# EAGLE board TinyNES_Main_Board (EAGLE 9.6.2), part 1 of 2
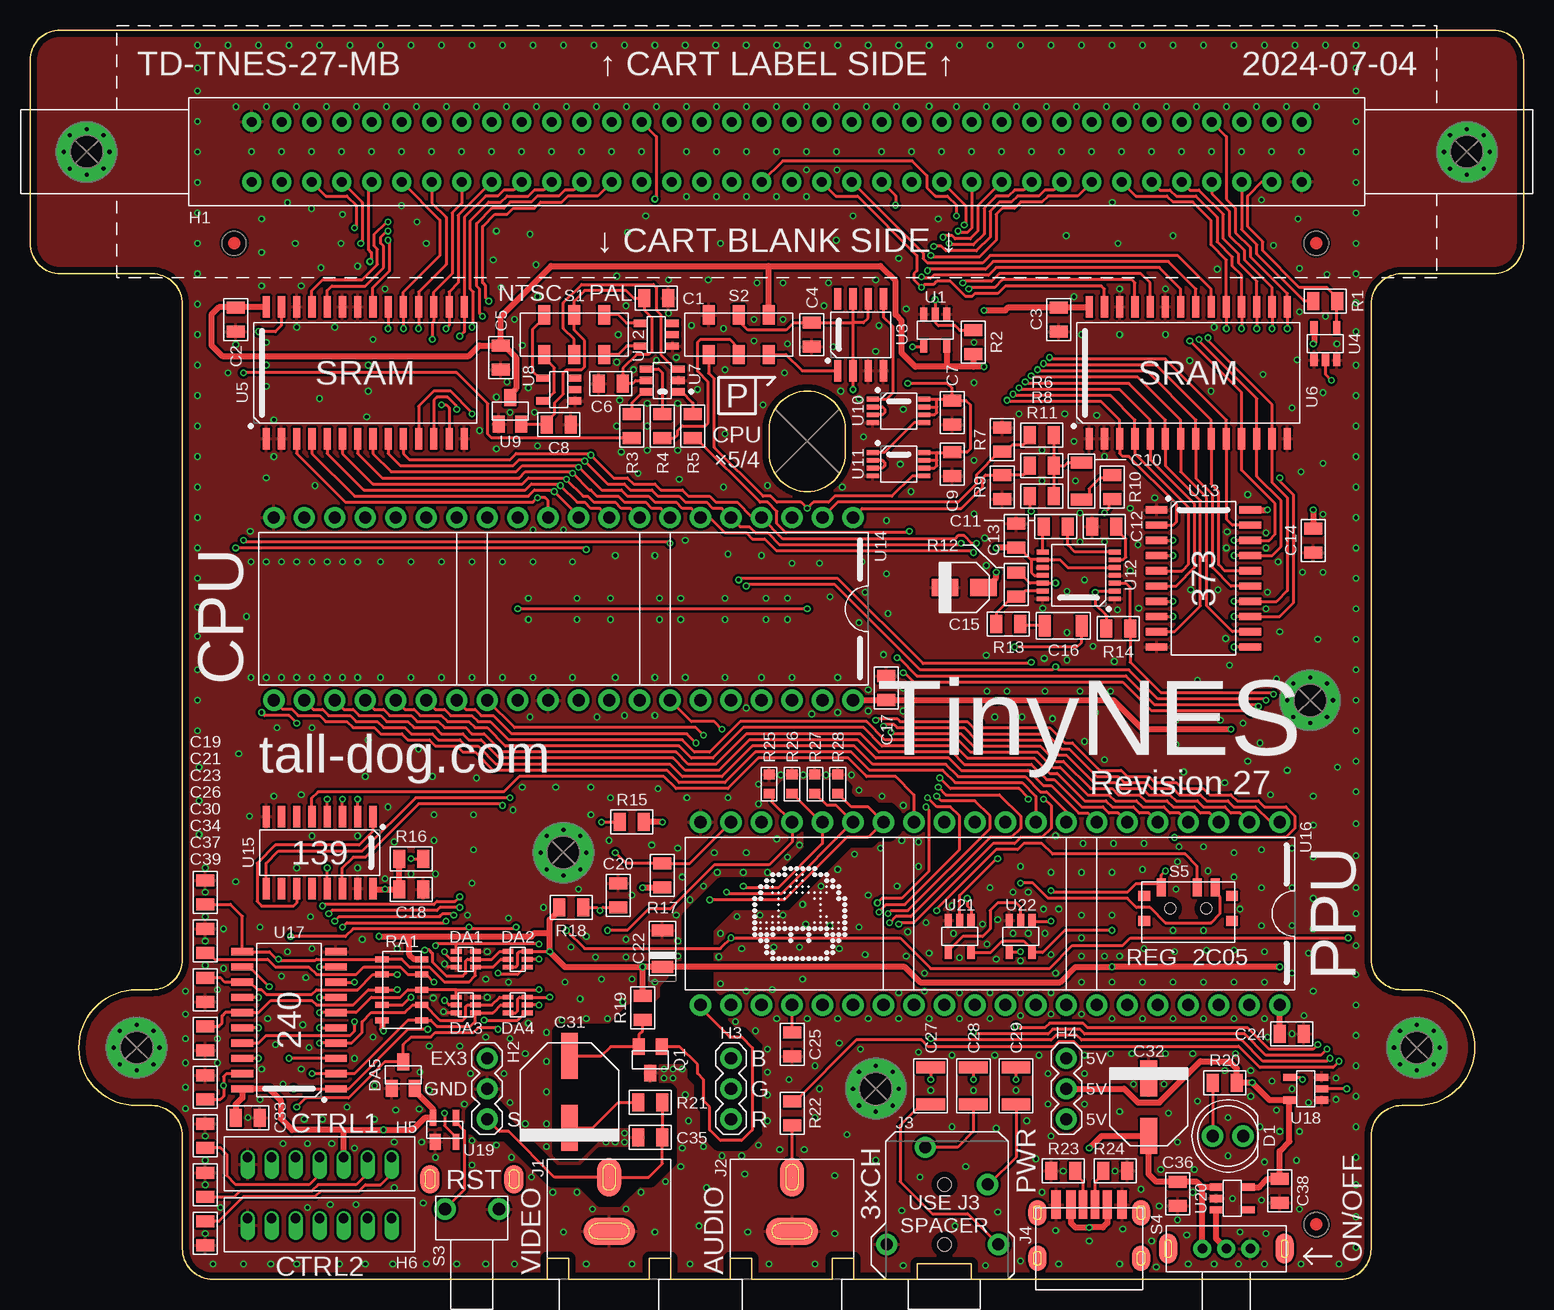
[diagram p1: board, top side]
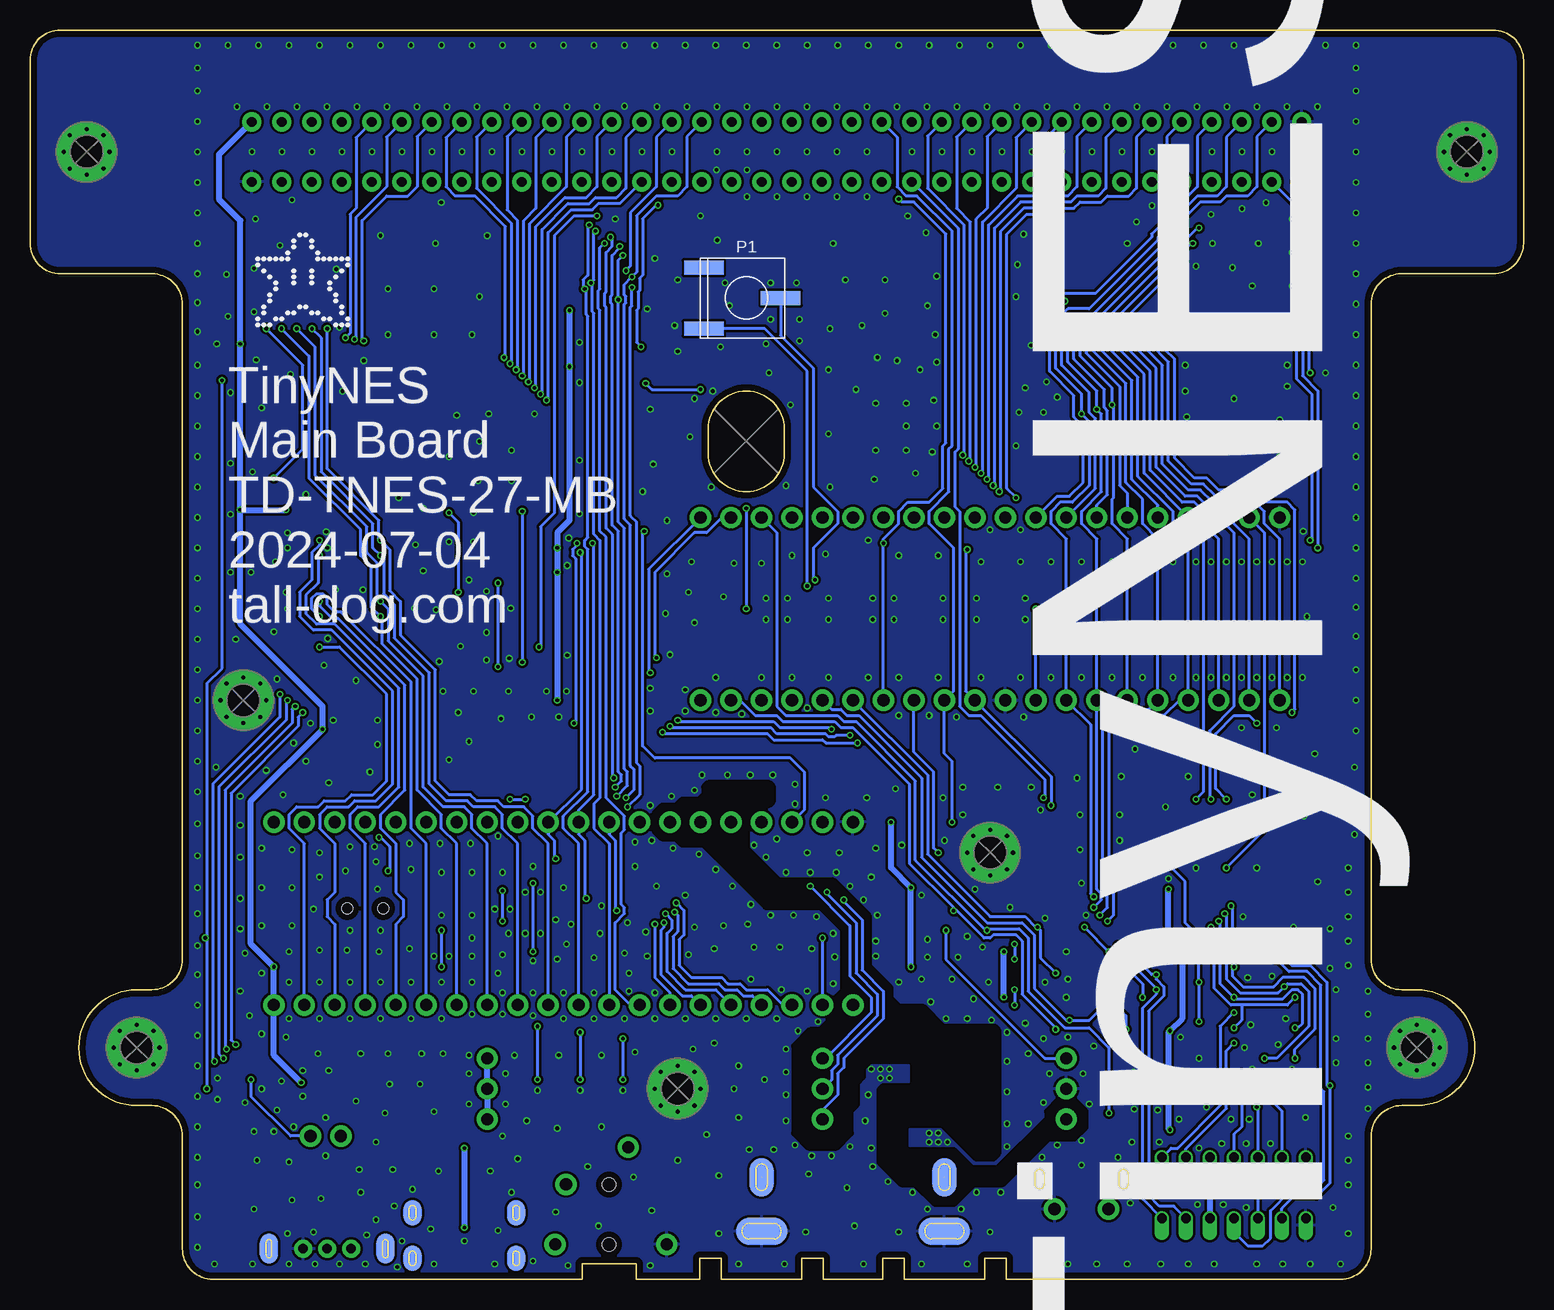
[diagram p2: board, bottom side, seen from below]

Size 124.46 x 104.14 mm. Coordinates in mm from the lower left corner, seen from the top.
Outline: 43.11,0 15.24,0 arc-90 12.7,2.54 12.7,11.94 arc90 10.16,14.48 8.89,14.48 arc-90 4.06,19.3 arc-90 8.89,24.13 10.16,24.13 arc90 12.7,26.67 12.7,81.28 arc90 10.16,83.82 2.54,83.82 arc-90 0,86.36 0,101.6 arc-90 2.54,104.14 121.92,104.14 arc-90 124.46,101.6 124.46,86.36 arc-90 121.92,83.82 114.3,83.82 arc90 111.76,81.28 111.76,26.67 arc90 114.3,24.13 115.57,24.13 arc-90 120.4,19.3 arc-90 115.57,14.48 114.3,14.48 arc90 111.76,11.94 111.76,2.54 arc-90 109.22,0 81.5,0
Outline: 53.41,0 58.35,0
Outline: 68.65,0 71.3,0
Outline: 61.59,70.87 arc-180 67.94,70.87 67.94,68.83 arc-180 61.59,68.83 61.59,70.87
Copper layers (1*16): Top 0.035mm / dielectric 1.5mm / Bottom 0.035mm
Design rules "default *": minimum track width 10mil, minimum drill 12mil, track to track 8mil, track to pad 8mil, pad to pad 8mil, via to via 6mil, smd to smd 8mil, copper to edge 20mil, drill to drill 14mil, minimum pad ring 5mil, minimum via ring 5mil, stop-mask expansion 0mil, vias tented up to drill 12mil, thermal gap 8mil
tRestrict: area 36.6,6.3 to 72.4,41.3
bRestrict: area 36.6,6.3 to 72.4,41.3

## Footprints (pad centres in the part's own frame; a part is rotated, then mirrored left to right if it is on the bottom)
0805-NP = smd 1 x 1.5: 1 -1,0; 2 1,0
1206-NP = smd 1 x 1.77: 1 -1.535,0; 2 1.535,0
ECAP-B = smd 2.2 x 1.4: A 1.6,0; C -1.6,0
1206-P = smd 1 x 1.77: N 1.535,0; P -1.535,0
1210-NP = smd 1 x 2.4: 1 -1.535,0; 2 1.535,0
ECAP-E = smd 3.8 x 1.4: A 3,0; C -3,0
ECAP-D = smd 3 x 1.4: A 2.4,0; C -2.4,0
LED-5MM = drill 1.016 pad 1.778: A -1.27,0; K 1.27,0
SOT-363-NP = smd 0.4 x 0.9: 1 -0.65,-0.8; 2 0,-0.8; 3 0.65,-0.8; 4 0.65,0.8; 5 0,0.8; 6 -0.65,0.8
SOT-23-3 = smd 1 x 1.4: 1 -0.95,-1.1; 2 0.95,-1.1; 3 0,1.1
CART-72-2.50-CONN-VERT = drill 0.8 pad 1.6: 1 43.75,-2.5; 2 41.25,-2.5; 3 38.75,-2.5; 4 36.25,-2.5; 5 33.75,-2.5; 6 31.25,-2.5; 7 28.75,-2.5; 8 26.25,-2.5; 9 23.75,-2.5; 10 21.25,-2.5; 11 18.75,-2.5; 12 16.25,-2.5; 13 13.75,-2.5; 14 11.25,-2.5; 15 8.75,-2.5; 16 6.25,-2.5; 17 3.75,-2.5; 18 1.25,-2.5; 19 -1.25,-2.5; 20 -3.75,-2.5; 21 -6.25,-2.5; 22 -8.75,-2.5; 23 -11.25,-2.5; 24 -13.75,-2.5; 25 -16.25,-2.5; 26 -18.75,-2.5; 27 -21.25,-2.5; 28 -23.75,-2.5; 29 -26.25,-2.5; 30 -28.75,-2.5; 31 -31.25,-2.5; 32 -33.75,-2.5; 33 -36.25,-2.5; 34 -38.75,-2.5; 35 -41.25,-2.5; 36 -43.75,-2.5; 37 43.75,2.5; 38 41.25,2.5; 39 38.75,2.5; 40 36.25,2.5; 41 33.75,2.5; 42 31.25,2.5; 43 28.75,2.5; 44 26.25,2.5; 45 23.75,2.5; 46 21.25,2.5; 47 18.75,2.5; 48 16.25,2.5; 49 13.75,2.5; 50 11.25,2.5; 51 8.75,2.5; 52 6.25,2.5; 53 3.75,2.5; 54 1.25,2.5; 55 -1.25,2.5; 56 -3.75,2.5; 57 -6.25,2.5; 58 -8.75,2.5; 59 -11.25,2.5; 60 -13.75,2.5; 61 -16.25,2.5; 62 -18.75,2.5; 63 -21.25,2.5; 64 -23.75,2.5; 65 -26.25,2.5; 66 -28.75,2.5; 67 -31.25,2.5; 68 -33.75,2.5; 69 -36.25,2.5; 70 -38.75,2.5; 71 -41.25,2.5; 72 -43.75,2.5
JST-PH-7 = drill 0.8 pad 1.2 offset: 1 6,0; 2 4,0; 3 2,0; 4 0,0; 5 -2,0; 6 -4,0; 7 -6,0
HOLE-M2.5 = drill 2.7 pad 5: P$1 0,0 | drill 0.35: P$6 1.4,1.4; P$7 1.9,0; P$8 1.4,-1.4; P$9 -1.4,-1.4; P$13 0,-1.9; P$14 -1.4,1.4; P$15 -1.9,0; P$16 0,1.9
RCJ = smd 2.3 x 4.3 bottom: 1B -4,0 | smd 2.3 x 4.3: 1T -4,0 | smd 3.2 x 2 bottom: 2B -8.5,0 | smd 3.2 x 2: 2T -8.5,0
SJ-43514 = drill 1.016 pad 1.778: 1 2.9,4.8; 2 7.9,-3.6; 3 11,1.6; 4 2.9,-4.5 | hole 1.1: 2.9,0; 7.9,0
USB4125 = smd 0.7 x 2.4: A5 -0.5,3.68; B5 0.5,3.68 | smd 0.76 x 2.4: A9 1.52,3.68; B9 -1.52,3.68 | smd 0.8 x 2.4: A12 2.75,3.68; B12 -2.75,3.68 | smd 1.5 x 2.1 bottom: S1B -4.32,3; S2B 4.32,3; S3B -4.32,-0.8; S4B 4.32,-0.8 | smd 1.5 x 2.1: S1T -4.32,3; S2T 4.32,3; S3T -4.32,-0.8; S4T 4.32,-0.8
POT-3361 = smd 1.19 x 3.3: 1 -2.54,-3.54; 2 0,2.86; 3 2.54,-3.54
0603-NP = smd 0.81 x 0.93: 1 -0.81,0; 2 0.81,0
EXBA10P = smd 0.5 x 1.1: 1 -2.54,-1.65; 2 -1.27,-1.65; 3 0,-1.65; 4 1.27,-1.65; 5 2.54,-1.65; 6 2.54,1.65; 7 1.27,1.65; 8 0,1.65; 9 -1.27,1.65; 10 -2.54,1.65
RGB-TOP = drill 1.016 pad 1.778: B -3.81,2.54; EXT3 -24.13,2.54; G -3.81,0; GND -24.13,0; R -3.81,-2.54; S -24.13,-2.54; VCC@1 24.13,2.54; VCC@2 24.13,0; VCC@3 24.13,-2.54
JS202011J = smd 1 x 1.6: AA -2.5,1.65; AB 2.5,1.65; ACOM 0,1.65; BA -2.5,-1.65; BB 2.5,-1.65; BCOM 0,-1.65
TL1105 = drill 1.016 pad 1.778: 1 -2.25,0; 2 2.25,0 | smd 1.6 x 2.4 bottom: G1B -3.5,2.5; G2B 3.5,2.5 | smd 1.6 x 2.4: G1T -3.5,2.5; G2T 3.5,2.5
EG1213 = drill 0.8 pad 1.5: 1 -2,0; 2 0,0; 3 2,0 | smd 1.5 x 2.5 bottom: G1B -4.85,0; G2B 4.85,0 | smd 1.5 x 2.5: G1T -4.85,0; G2T 4.85,0
CUS-12TB = smd 0.711 x 1.499: 1 -2.25,2.052; 2 0.75,2.052; 3 2.25,2.052 | smd 0.991 x 0.813: 6 -3.65,1.352; 7 3.65,1.352; 8 -3.65,-0.748; 9 3.65,-0.748 | hole 0.9: -1.5,0.305; 1.5,0.305
SOT-23-5 = smd 0.6 x 1.05: 1 -0.95,-1.35; 2 0,-1.35; 3 0.95,-1.35; 4 0.95,1.35; 5 -0.95,1.35
SOIC-8 = smd 0.6 x 1.8: 1 -1.905,-3; 2 -0.635,-3; 3 0.635,-3; 4 1.905,-3; 5 1.905,3; 6 0.635,3; 7 -0.635,3; 8 -1.905,3
SOIC-28 = smd 0.6 x 1.8: 1 -8.255,-5.5; 2 -6.985,-5.5; 3 -5.715,-5.5; 4 -4.445,-5.5; 5 -3.175,-5.5; 6 -1.905,-5.5; 7 -0.635,-5.5; 8 0.635,-5.5; 9 1.905,-5.5; 10 3.175,-5.5; 11 4.445,-5.5; 12 5.715,-5.5; 13 6.985,-5.5; 14 8.255,-5.5; 15 8.255,5.5; 16 6.985,5.5; 17 5.715,5.5; 18 4.445,5.5; 19 3.175,5.5; 20 1.905,5.5; 21 0.635,5.5; 22 -0.635,5.5; 23 -1.905,5.5; 24 -3.175,5.5; 25 -4.445,5.5; 26 -5.715,5.5; 27 -6.985,5.5; 28 -8.255,5.5
SOT-23-6 = smd 0.6 x 1.05: 1 -0.95,-1.35; 2 0,-1.35; 3 0.95,-1.35; 4 0.95,1.35; 5 0,1.35; 6 -0.95,1.35
TSSOP-8 = smd 1 x 0.4: 1 -2.15,0.975; 2 -2.15,0.325; 3 -2.15,-0.325; 4 -2.15,-0.975; 5 2.15,-0.975; 6 2.15,-0.325; 7 2.15,0.325; 8 2.15,0.975
TSSOP-14 = smd 1 x 0.4: 1 -3,1.95; 2 -3,1.3; 3 -3,0.65; 4 -3,0; 5 -3,-0.65; 6 -3,-1.3; 7 -3,-1.95; 8 3,-1.95; 9 3,-1.3; 10 3,-0.65; 11 3,0; 12 3,0.65; 13 3,1.3; 14 3,1.95
SOIC-20 = smd 0.6 x 1.8: 1 -5.715,-3.9; 2 -4.445,-3.9; 3 -3.175,-3.9; 4 -1.905,-3.9; 5 -0.635,-3.9; 6 0.635,-3.9; 7 1.905,-3.9; 8 3.175,-3.9; 9 4.445,-3.9; 10 5.715,-3.9; 11 5.715,3.9; 12 4.445,3.9; 13 3.175,3.9; 14 1.905,3.9; 15 0.635,3.9; 16 -0.635,3.9; 17 -1.905,3.9; 18 -3.175,3.9; 19 -4.445,3.9; 20 -5.715,3.9
DIP-40 = drill 1.016 pad 1.778: 1 -7.62,24.13; 2 -7.62,21.59; 3 -7.62,19.05; 4 -7.62,16.51; 5 -7.62,13.97; 6 -7.62,11.43; 7 -7.62,8.89; 8 -7.62,6.35; 9 -7.62,3.81; 10 -7.62,1.27; 11 -7.62,-1.27; 12 -7.62,-3.81; 13 -7.62,-6.35; 14 -7.62,-8.89; 15 -7.62,-11.43; 16 -7.62,-13.97; 17 -7.62,-16.51; 18 -7.62,-19.05; 19 -7.62,-21.59; 20 -7.62,-24.13; 21 7.62,-24.13; 22 7.62,-21.59; 23 7.62,-19.05; 24 7.62,-16.51; 25 7.62,-13.97; 26 7.62,-11.43; 27 7.62,-8.89; 28 7.62,-6.35; 29 7.62,-3.81; 30 7.62,-1.27; 31 7.62,1.27; 32 7.62,3.81; 33 7.62,6.35; 34 7.62,8.89; 35 7.62,11.43; 36 7.62,13.97; 37 7.62,16.51; 38 7.62,19.05; 39 7.62,21.59; 40 7.62,24.13
SOIC-16 = smd 0.6 x 1.8: 1 -4.445,-3; 2 -3.175,-3; 3 -1.905,-3; 4 -0.635,-3; 5 0.635,-3; 6 1.905,-3; 7 3.175,-3; 8 4.445,-3; 9 4.445,3; 10 3.175,3; 11 1.905,3; 12 0.635,3; 13 -0.635,3; 14 -1.905,3; 15 -3.175,3; 16 -4.445,3
SOT-143 = smd 0.94 x 1.31: 1 -0.765,-1 | smd 0.55 x 1.31: 2 0.96,-1; 3 0.96,1; 4 -0.96,1

## Placement (x,y rotation side)
C1  1u  [0805-NP]  52.2,81.79 0 top
C2  0.1u  [0805-NP]  17.14,80.01 270 top
C3  0.1u  [0805-NP]  85.72,80.01 270 top
C4  10n  [0805-NP]  65.15,78.74 90 top
C5  1u  [0805-NP]  39.24,76.83 270 top
C6  0.1u  [0805-NP]  48.39,74.68 180 top
C7  0.1u  [0805-NP]  76.83,72.26 270 top
C8  0.1u  [0805-NP]  44.07,71.25 0 top
C9  0.1u  [0805-NP]  76.83,67.94 270 top
C10  0.47u  [1206-NP]  87.63,66.55 90 top
C11  1u  [0805-NP]  85.47,62.74 180 top
C12  1u  [0805-NP]  89.53,62.74 0 top
C13  1u  [0805-NP]  82.17,61.98 270 top
C14  0.1u  [0805-NP]  106.93,61.59 270 top
C15  10u  [ECAP-B]  77.85,57.66 0 top
C16  0.47u  [1206-NP]  86.11,54.48 180 top
C17  0.1u  [0805-NP]  71.37,49.28 90 top
C18  0.1u  [0805-NP]  31.75,32.51 0 top
C19  330p  [0805-NP]  14.61,32.26 270 top
C20  330p  [0805-NP]  49.02,32 270 top
C21  330p  [0805-NP]  14.61,28.19 270 top
C22  10u  [1206-P]  52.7,27.56 90 top
C23  330p  [0805-NP]  14.61,24.13 90 top
C24  0.1u  [0805-NP]  105.16,20.45 0 top
C25  DNP  [0805-NP]  63.5,19.56 90 top
C26  330p  [0805-NP]  14.61,20.07 90 top
C27  1u  [1210-NP]  75.06,16.13 270 top
C28  1u  [1210-NP]  78.61,16.13 270 top
C29  1u  [1210-NP]  82.17,16.13 270 top
C30  330p  [0805-NP]  14.61,16 270 top
C31  220u  [ECAP-E]  44.96,15.62 90 top
C32  100u  [ECAP-D]  93.22,14.35 270 top
C33  0.1u  [0805-NP]  18.16,13.46 0 top
C34  330p  [0805-NP]  14.61,11.94 270 top
C35  560p  [0805-NP]  51.69,11.81 0 top
C36  4.7u  [0805-NP]  95.63,7.11 90 top
C37  330p  [0805-NP]  14.61,7.87 270 top
C38  0.1u  [0805-NP]  104.14,7.37 90 top
C39  330p  [0805-NP]  14.61,3.81 90 top
D1  LED  [LED-5MM]  99.82,11.94 0 top
DA1  DA4-CA-SOT-363  [SOT-363-NP]  36.32,26.67 90 top
DA2  DA4-CK-SOT-363  [SOT-363-NP]  40.64,26.67 90 top
DA3  DA4-CA-SOT-363  [SOT-363-NP]  36.32,22.86 90 top
DA4  DA4-CK-SOT-363  [SOT-363-NP]  40.64,22.86 90 top
DA5  DA2-S  [SOT-23-3]  31.11,17.02 0 top
FICUCIAL1  FICUCIAL  [FIDUCIAL]  17.02,86.36 0 top
FICUCIAL2  FICUCIAL  [FIDUCIAL]  107.19,86.36 0 top
FICUCIAL3  FICUCIAL  [FIDUCIAL]  107.19,4.57 0 top
H1  CART  [CART-72-2.50-CONN-VERT]  62.23,93.98 180 top
H5  CTRL1  [JST-PH-7]  24.13,10.16 180 top
H6  CTRL2  [JST-PH-7]  24.13,5.08 180 top
HOLE1  HOLE-M2.5  [HOLE-M2.5]  4.72,93.98 0 top
HOLE2  HOLE-M2.5  [HOLE-M2.5]  119.74,93.98 0 top
HOLE3  HOLE-M2.5  [HOLE-M2.5]  106.68,48.26 0 top
HOLE4  HOLE-M2.5  [HOLE-M2.5]  44.45,35.56 0 top
HOLE5  HOLE-M2.5  [HOLE-M2.5]  8.89,19.3 0 top
HOLE6  HOLE-M2.5  [HOLE-M2.5]  115.57,19.3 0 top
HOLE7  HOLE-M2.5  [HOLE-M2.5]  70.48,15.88 0 top
J1  VIDEO  [RCJ]  48.26,0 270 top
J2  AUDIO  [RCJ]  63.5,0 270 top
J3  TRRS  [SJ-43514]  76.2,0 90 top
J4  USB-C  [USB4125]  88.27,2.54 0 top
P1  100k  [POT-3361]  64.77,81.79 270 bottom
Q1  3906  [SOT-23-3]  51.69,18.29 180 top
R1  100k  [0805-NP]  107.95,81.53 0 top
R2  10k  [0805-NP]  78.61,78.11 270 top
R3  30R  [0805-NP]  50.16,71.12 90 top
R4  30R  [0805-NP]  52.7,71.12 90 top
R5  30R  [0805-NP]  55.24,71.12 90 top
R6  12k  [0805-NP]  84.33,70.36 0 top
R7  68R  [0805-NP]  81.03,69.98 270 top
R8  20k  [0805-NP]  84.33,67.82 0 top
R9  68R  [0805-NP]  81.03,66.04 90 top
R10  22k  [0805-NP]  90.17,66.04 270 top
R11  12k  [0805-NP]  84.33,65.28 0 top
R12  22k  [0805-NP]  82.17,57.91 90 top
R13  22k  [0805-NP]  81.53,54.61 180 top
R14  80.6k  [0805-NP]  90.68,54.23 0 top
R15  10k  [0805-NP]  50.16,38.1 0 top
R16  10k  [0805-NP]  31.75,35.05 180 top
R17  10k  [0805-NP]  52.7,33.66 270 top
R18  10k  [0805-NP]  45.09,30.99 180 top
R19  300R  [0805-NP]  51.05,22.61 270 top
R20  270R  [0805-NP]  99.57,16.38 0 top
R21  110R  [0805-NP]  51.69,14.73 0 top
R22  150R  [0805-NP]  63.5,13.84 270 top
R23  5.1k  [0805-NP]  86.11,9.02 0 top
R24  5.1k  [0805-NP]  90.42,9.02 180 top
R25  10k  [0603-NP]  61.59,41.27 270 top
R26  10k  [0603-NP]  63.5,41.27 270 top
R27  10k  [0603-NP]  65.41,41.27 270 top
R28  10k  [0603-NP]  67.31,41.27 270 top
RA1  10k  [EXBA10P]  30.99,24.13 90 top
RGB  RGB-TOP  [RGB-TOP]  62.23,15.88 0 top
S1  DPDT-LONG  [JS202011J]  45.34,78.74 180 top
S2  DPDT  [JS202011J]  59.05,78.74 0 top
S3  SWITCH  [TL1105]  36.83,5.84 0 top
S4  SPDT-EG1213  [EG1213]  99.69,2.54 0 top
S5  SPDT-CUS-12TB  [CUS-12TB]  96.52,30.61 0 top
STAR  STAR  [_PIXEL-ART-STAR]  101.73,83.31 0 bottom
U1  BUFFER  [SOT-23-5]  75.44,79.12 180 top
U2  SIT2001B  [SOT-23-5]  52.2,78.74 90 top
U3  ICS501  [SOIC-8]  69.22,78.74 0 top
U4  BUFFER  [SOT-23-5]  107.95,77.98 0 top
U5  2KB  [SOIC-28]  27.94,75.56 0 top
U6  2KB  [SOIC-28]  96.52,75.56 0 top
U7  PL133-37  [SOT-23-6]  52.7,74.93 90 top
U8  SIT2001B  [SOT-23-5]  44.07,74.17 90 top
U9  AP2138N  [SOT-23-3]  40.01,72.39 0 top
U10  74X1G74  [TSSOP-8]  72.39,72.39 0 top
U11  74X1G74  [TSSOP-8]  72.39,67.94 0 top
U12  NCS603  [TSSOP-14]  87.38,58.67 180 top
U13  74X373  [SOIC-20]  97.79,58.42 270 top
U14  CPU  [DIP-40]  44.45,55.88 270 top
U15  74X139  [SOIC-16]  24.13,35.56 180 top
U16  PPU  [DIP-40]  80.01,30.48 270 top
U17  74X240  [SOIC-20]  21.59,21.59 90 top
U18  BUFFER  [SOT-23-5]  106.3,15.88 90 top
U19  APX811  [SOT-143]  34.54,12.45 0 top
U20  FPF210X  [SOT-23-5]  100.2,6.73 270 top
U21  NOR  [SOT-23-5]  77.47,28.57 180 top
U22  XOR  [SOT-23-5]  82.55,28.57 180 top
U$1  [_PIXEL-ART-1UP]  64.14,30.48 0 top
U$2  [_PIXEL-ART-LEAF]  29.21,55.5 0 top

## Tracks (layer width: path | path; a pad name or v marks a point on that pad's centre or on a via)
1Y0-!CS  (via drill 0.3 pad 0.51)
  Top 0.254: U15.4 v24.77,40.01 | v22.23,46.35 21.59,46.99 19.56,46.99 v19.3,47.24 | U5.20 v29.84,79.25
  Bottom 0.254: v24.77,40.01 25.65,40.89 25.65,45.47 24.13,46.99 22.86,46.99 v22.23,46.35 | v19.3,47.24 19.05,47.5 19.05,64.14 19.68,64.77 21.59,64.77 22.1,65.28 23.88,65.28 24.38,65.79 25.4,65.79 26.42,66.8 27.43,66.8 29.08,68.45 29.08,76.71 29.84,77.47 v29.84,79.25
3V3
  Top 0.254: U7.5 50.47,74.93 50.21,74.68 49.4,74.68 | 49.4,74.68 C6.1 | U9.2 41,71.25 C8.1 43.07,71.5 43.7,72.14 43.7,73.04 44.45,73.79 44.45,75.56 44.7,75.82 45.97,75.82 46.23,76.07 46.23,78.23 45.34,79.12 S1.BCOM 45.34,81.53 46.23,82.42 49.67,82.42 50.31,81.79 C1.1 51.2,80.77 51.82,80.15 51.82,77.34 51.56,77.09 50.55,77.09 49.4,75.95 49.4,74.68
!IRQ  (via drill 0.3 pad 0.51)
  Top 0.254: v47.62,38.1 R15.1
  Bottom 0.254: H1.15 52.2,95.2 52.2,91.06 51.44,90.3 50.55,90.3 47.62,87.38 47.62,69.47 47.88,69.22 47.88,65.66 49.53,64.01 49.53,62.99 47.5,60.96 47.5,49.02 U14.32 48.26,43.81 47.62,43.18 v47.62,38.1
!NMI  (via drill 0.3 pad 0.51)
  Top 0.254: U16.19 54.98,34.66 R17.1 49.67,34.66 v48.77,35.56
  Bottom 0.254: v48.77,35.56 49.15,35.94 49.15,42.29 50.8,43.94 U14.33
!OE1  (via drill 0.3, 0.3 pad 0.51)
  Top 0.254: DA4.1 41.26,22.21 40.64,21.59 v37.85,21.59 | v33.66,24.77 33.02,25.4 RA1.4 31.5,25.4 30.86,26.04 27.81,26.04 27.18,25.4 23.88,25.4 23.24,26.04 20.45,26.04 19.81,26.67 15.38,26.67 14.86,27.19 C21.2 | DA3.5 34.92,22.86 v34.54,23.24 | v21.97,15.88 U17.1 26.54,15.88 31.5,20.83 v33.15,20.83
  Bottom 0.254: U14.36 57.66,47.5 56.9,47.5 56.39,46.99 55.37,46.99 50.16,41.78 50.16,35.18 44.7,29.72 41.78,29.72 40.77,28.7 40.77,24.26 38.1,21.59 v37.85,21.59 36.2,21.59 v34.54,23.24 | v33.15,20.83 33.15,21.97 34.42,23.24 v34.54,23.24 | v21.97,15.88 20.13,14.03 H5.2 | v33.66,24.77 34.54,23.88 v34.54,23.24
!OE2  (via drill 0.3, 0.3 pad 0.51)
  Top 0.254: v38.99,25.53 39.12,25.4 40.64,25.4 41.26,26.02 DA2.1 | RA1.9 31.05,22.86 31.69,23.5 v31.75,23.5 | v40.51,29.34 40.39,29.21 36.7,29.21 v36.58,29.34 36.45,29.21 26.92,29.21 26.29,28.57 v21.72,28.57 | U17.19 16.38,17.14 16.13,16.89 v16.13,16.13 16.13,15.26 15.88,15 C30.2 | v34.54,27.3 34.54,27.18 35.05,26.67 DA1.5
  Bottom 0.254: H6.2 20.13,5.91 19.18,6.86 17.27,6.86 16.13,8 v16.13,16.13 16.38,16.13 16.38,24.77 17.78,26.16 19.3,26.16 v21.72,28.57 | v31.75,23.5 31.75,24.64 34.42,27.3 v34.54,27.3 v36.58,29.34 | U14.35 49.66,42.04 49.66,35.43 44.45,30.23 41.53,30.23 40.64,29.34 v40.51,29.34 40.26,29.08 40.26,26.8 v38.99,25.53
!PA13  (via drill 0.3 pad 0.51)
  Top 0.254: v73.53,77.72 73.91,77.72 74.42,77.72 74.44,77.72 U1.4 | H1.58 72.14,90.32 v72.14,89.53
  Bottom 0.254: v72.14,89.53 72.26,89.53 73.41,88.39 73.41,83.69 73.66,83.44 73.66,82.42 73.79,82.3 73.79,80.9 73.91,80.77 73.91,78.11 v73.53,77.72
!ROMSEL  (via drill 0.3 pad 0.51)
  Top 0.254: v40.01,40.13 32.13,40.13 27.69,35.69 20.7,35.69 19.68,34.67 U15.9
  Bottom 0.254: v40.01,40.13 39.88,40.26 39.88,41.66 45.21,46.99 46.23,46.99 46.99,47.75 46.99,64.01 47.37,64.39 47.37,68.96 47.12,69.22 47.12,87.62 H1.50
A0  (via drill 0.3 pad 0.51)
  Top 0.254: U5.10 31.11,68.83 31.62,68.33 40.01,68.33 40.51,68.83 46.61,68.83 v46.74,68.71 48.64,66.8 49.78,66.8 50.29,66.29 52.07,66.29 52.58,65.79 54.36,65.79 54.86,65.28 56.64,65.28 57.15,64.77 58.93,64.77 60.2,63.5 U14.4 62.74,61.72 77.09,61.72 77.34,61.98 77.85,61.98 78.49,61.34 v78.87,61.34 | v79.12,46.35 79.12,46.23 79.38,45.97 84.96,45.97 86.23,44.7 86.87,44.7 89.15,42.42 90.93,42.42 91.44,41.91 93.22,41.91 93.73,41.4 95.5,41.4 96.01,40.89 97.79,40.89 98.3,40.39 100.08,40.39 100.58,39.88 102.36,39.88 102.87,39.37 104.65,39.37 105.41,38.61 105.41,37.59 104.65,36.83 v95.38,36.83 | v94.61,34.04 94.27,33.69 S5.1 93.98,32.95 92.13,32.95 91.44,32.26 85.22,32.26 v85.09,32.38 | U22.1 83.58,29.84 v85.09,29.84
  Bottom 0.254: v46.74,68.71 46.61,68.83 46.61,87.88 49.66,90.93 49.66,95.3 H1.13 | v78.87,61.34 78.87,61.21 79.25,60.83 79.25,60.33 78.99,60.07 78.99,46.48 v79.12,46.35 | v95.38,36.83 95.25,36.83 94.49,36.07 94.49,34.16 v94.61,34.04 | v85.09,32.38 v85.09,29.84
A0-NOR
  Top 0.254: U21.4 76.52,27.37 77.72,28.57 79.38,28.57 80.01,29.21 80.01,30.73 80.64,31.37 82.17,31.37 82.55,30.99 U22.2
A0-PPU  (via drill 0.3 pad 0.51)
  Top 0.254: S5.2 97.27,34.43 96.27,35.43 85.22,35.43 84.33,36.32 82.8,36.32 82.3,35.81 80.52,35.81 75.56,30.86 v75.56,30.73
  Bottom 0.254: U16.12 76.2,37.08 75.69,36.58 75.69,30.86 v75.56,30.73
A0-XOR  (via drill 0.3 pad 0.51)
  Top 0.254: S5.3 98.77,32.28 99.19,31.86 99.19,30.48 98.42,29.72 94.61,29.72 93.34,30.99 92.2,30.99 91.44,31.75 84.84,31.75 83.57,33.02 v82.55,33.02 | U22.4 81.68,27.3 v82.55,27.3
  Bottom 0.254: v82.55,33.02 v82.55,27.3
A1  (via drill 0.3 pad 0.51)
  Top 0.254: U5.9 29.84,68.83 30.86,67.82 40.26,67.82 40.77,68.33 46.1,68.33 v46.23,68.2 48.13,66.29 49.53,66.29 50.04,65.79 51.82,65.79 52.32,65.28 54.1,65.28 54.61,64.77 56.39,64.77 56.9,64.26 57.66,64.26 U14.5 59.18,62.74 59.94,62.74 60.45,62.23 61.47,62.23 62.48,61.21 77.47,61.21 v77.6,61.34 | v78.11,31.75 78.11,31.11 78.42,30.8 U21.1
  Bottom 0.254: v46.23,68.2 46.1,68.33 46.1,88.14 47.24,89.28 47.24,95.22 H1.12 | v77.6,61.34 77.47,61.21 77.47,40.39 78.74,39.12 U16.11 78.74,37.08 78.23,36.58 78.23,31.88 v78.11,31.75
A2  (via drill 0.3 pad 0.51)
  Top 0.254: U5.8 28.57,68.83 30.1,67.31 40.51,67.31 41.02,67.82 45.59,67.82 v45.72,67.69 47.62,65.79 49.28,65.79 49.78,65.28 51.56,65.28 52.07,64.77 53.85,64.77 54.36,64.26 55.12,64.26 U14.6 56.64,63.5 57.91,62.23 59.69,62.23 60.2,61.72 61.21,61.72 62.23,60.71 78.49,60.71 v78.61,60.58 | U21.2 77.47,32 80.52,35.05 v80.64,35.05
  Bottom 0.254: v45.72,67.69 45.59,67.82 45.59,88.39 44.7,89.28 44.7,95.26 H1.11 | v78.61,60.58 78.49,60.45 78.49,40.83 81.22,38.1 U16.10 81.28,37.08 80.77,36.58 80.77,35.18 v80.64,35.05
A3  (via drill 0.3 pad 0.51)
  Top 0.254: U5.7 27.3,68.83 29.34,66.8 40.77,66.8 41.27,67.31 45.09,67.31 v45.21,67.18 46.61,65.79 46.74,65.79 47.24,65.28 49.02,65.28 49.53,64.77 51.31,64.77 51.82,64.26 52.58,64.26 U14.7
  Bottom 0.254: v45.21,67.18 45.09,67.31 45.09,88.14 42.29,90.93 42.29,95.17 H1.10
A4  (via drill 0.3 pad 0.51)
  Top 0.254: U5.6 26.04,68.83 28.57,66.29 41.02,66.29 41.53,66.8 44.58,66.8 v44.7,66.67 46.1,65.28 46.48,65.28 46.99,64.77 48.77,64.77 49.28,64.26 50.04,64.26 U14.8
  Bottom 0.254: v44.7,66.67 44.58,66.8 44.58,87.88 42.16,90.3 40.51,90.3 39.75,91.06 39.75,95.21 H1.9
A5  (via drill 0.3 pad 0.51)
  Top 0.254: U5.5 24.77,68.83 27.81,65.79 41.27,65.79 41.78,66.29 44.07,66.29 v44.2,66.17 45.59,64.77 46.23,64.77 46.74,64.26 47.5,64.26 U14.9
  Bottom 0.254: v44.2,66.17 44.07,66.29 44.07,87.63 41.91,89.79 40.26,89.79 39.75,90.3 37.97,90.3 37.21,91.06 37.21,95.25 H1.8
A6  (via drill 0.3 pad 0.51)
  Top 0.254: U14.10 45.72,63.63 v43.69,65.66 43.56,65.79 42.04,65.79 41.53,65.28 27.05,65.28 23.5,68.83 U5.4
  Bottom 0.254: v43.69,65.66 43.56,65.79 43.56,87.38 41.66,89.28 40.01,89.28 39.5,89.79 37.72,89.79 37.21,90.3 35.43,90.3 34.8,90.93 34.8,95.16 H1.7
A7  (via drill 0.3 pad 0.51)
  Top 0.254: U5.3 22.23,68.83 26.29,64.77 41.91,64.77 v42.29,65.15 42.93,65.15 43.18,64.9 U14.11
  Bottom 0.254: v42.29,65.15 43.05,65.91 43.05,87.12 41.4,88.77 39.75,88.77 39.24,89.28 37.47,89.28 36.96,89.79 35.18,89.79 34.67,90.3 32.89,90.3 32.26,90.93 32.26,95.2 H1.6
A8  (via drill 0.3 pad 0.51)
  Top 0.254: v29.84,88.14 29.72,88.14 28.7,87.12 28.7,86.11 28.96,85.85 28.96,84.58 27.69,83.31 24.38,83.31 23.5,82.42 U5.25
  Bottom 0.254: U14.12 38.86,65.28 37.85,65.28 36.7,66.42 36.7,71.12 37.47,71.88 37.47,73.66 39.5,75.69 39.5,81.15 38.48,82.17 35.69,82.17 30.99,86.87 30.99,87.12 29.97,88.14 v29.84,88.14 29.72,88.27 29.72,95.24 H1.5
A9  (via drill 0.3 pad 0.51)
  Top 0.254: v29.84,87.38 29.72,87.38 29.21,86.87 29.21,86.36 29.46,86.11 29.46,84.33 27.94,82.8 25.15,82.8 24.77,82.42 U5.24
  Bottom 0.254: U14.13 35.69,65.91 35.69,71.75 36.2,72.26 36.2,73.91 38.48,76.2 38.48,80.39 37.97,80.9 36.2,80.9 30.48,86.61 30.48,86.87 29.97,87.38 v29.84,87.38 29.72,87.38 29.21,87.88 29.21,89.03 27.18,91.06 27.18,95.28 H1.4
A10  (via drill 0.3 pad 0.51)
  Top 0.254: U5.21 28.57,82.68 29.97,84.07 29.97,86.49 v29.84,86.61
  Bottom 0.254: U14.14 35.56,64.52 34.67,65.41 34.67,72.39 34.92,72.64 34.92,74.17 37.47,76.71 37.47,79.63 37.08,80.01 36.32,80.01 29.84,86.49 v29.84,86.61 29.72,86.61 28.7,87.63 28.7,88.77 27.18,90.3 25.53,90.3 24.77,91.06 24.77,95.19 H1.3
A11
  Bottom 0.254: U14.15 33.02,65.53 33.66,66.17 33.66,74.42 36.45,77.22 36.45,78.87 36.2,79.12 36.2,79.38 28.19,87.38 28.19,88.52 26.92,89.79 25.27,89.79 24.77,90.3 22.99,90.3 22.23,91.06 22.23,95.23 H1.2
A12  (via drill 0.3 pad 0.51)
  Top 0.254: v27.05,87.63 27.18,87.76 27.18,89.53 26.42,90.3 24.66,90.3 H1.39
  Bottom 0.254: U14.16 30.48,64.52 32.64,66.67 32.64,74.93 35.18,77.47 35.18,78.87 35.31,78.99 35.31,79.5 27.18,87.63 v27.05,87.63
A13  (via drill 0.3 pad 0.51)
  Top 0.254: v27.56,86.36 27.69,86.49 27.69,89.77 H1.40 | U15.2 v27.3,40.01
  Bottom 0.254: v27.56,86.36 27.69,86.36 33.66,80.39 33.66,79.12 34.16,78.61 34.16,77.98 31.62,75.44 31.62,67.18 U14.17 26.67,62.23 26.67,40.64 v27.3,40.01
A14  (via drill 0.3 pad 0.51)
  Top 0.254: v28.32,84.84 28.45,84.96 28.45,85.6 28.19,85.85 28.19,91.19 H1.41 | U15.3 v26.04,40.01
  Bottom 0.254: v26.04,40.01 26.16,40.13 26.16,45.72 24.13,47.75 24.13,62.23 U14.18 27.18,65.28 28.19,65.28 30.61,67.69 30.61,75.95 32.89,78.23 32.89,78.74 33.15,78.99 33.15,80.14 28.45,84.84 v28.32,84.84
A15  (via drill 0.3 pad 0.51)
  Top 0.254: U15.13 v24.77,34.29
  Bottom 0.254: U14.19 21.59,62.23 21.59,37.47 v24.77,34.29
ALE  (via drill 0.3 pad 0.51)
  Top 0.254: U13.11 v100.33,52.7
  Bottom 0.254: U16.39 101.6,36.32 102.87,37.59 102.87,38.73 102.23,39.37 100.46,39.37 99.95,39.88 98.17,39.88 97.66,40.39 95.89,40.39 94.74,41.53 94.74,48.77 98.68,52.7 v100.33,52.7
AUDIO1-AC
  Top 0.254: C29.2 82.17,10.16 79.91,7.9 J3.2
AUDIO1-DC  (via drill 0.3 pad 0.51, 0.3 pad 0.56)
  Top 0.254: U14.1 69.34,64.26 77.6,64.26 79.38,66.04 79.38,66.8 79.61,67.04 R9.2 82.8,67.04 83.33,67.56 R8.1 | v82.17,16.64 C29.1 | v72.77,50.55 72.9,50.55 73.66,49.78 91.06,49.78 93.47,47.37 101.6,47.37 v101.73,47.24 | v107.31,19.56 106.93,19.18 103.25,19.18 101.47,20.95 88.14,20.95 87.76,21.34 84.96,21.34 84.58,20.95 82.42,20.95 82.3,21.08 v82.17,21.08
  Bottom 0.254: U14.1 72.9,59.18 72.9,50.67 v72.77,50.55 | v82.17,21.08 v82.17,16.64 | v101.73,47.24 102.11,46.86 102.11,46.1 107.7,40.51 107.7,19.94 v107.31,19.56
AUDIO2-AC
  Top 0.254: J3.3 77.29,11 78.61,12.32 C28.2
AUDIO2-DC  (via drill 0.3 pad 0.51, 0.3 pad 0.56)
  Top 0.254: U14.2 67.31,64.77 77.34,64.77 78.87,66.29 78.87,67.06 80.79,68.98 R7.2 81.28,68.98 81.84,69.54 82.76,69.54 83.33,70.1 R6.1 | C28.1 v78.61,16.64 | v72.26,51.82 72.39,51.82 73.91,50.29 91.31,50.29 93.73,47.88 102.23,47.88 v102.36,47.75 | v108.08,19.18 107.57,18.67 103,18.67 101.22,20.45 87.88,20.45 87.5,20.83 85.22,20.83 84.84,20.45 78.74,20.45 v78.61,20.57
  Bottom 0.254: U14.2 66.8,63.5 68.07,62.23 69.09,62.23 72.39,58.93 72.39,51.94 v72.26,51.82 | v78.61,20.57 v78.61,16.64 | v102.36,47.75 102.62,47.5 102.62,46.35 108.2,40.77 108.2,19.18 v108.08,19.18
AUDIO-MIX
  Top 0.254: R6.2 R8.2 | C10.2 86.49,68.08 86.22,67.82 R8.2 | R8.2 R11.2
AUDIO-MIX-1
  Top 0.254: R10.1 89.92,66.79 89.15,66.79 88.27,65.9 88.27,65.01 C10.1
AUDIO-MIX-2  (via drill 0.3 pad 0.56)
  Top 0.254: R14.1 89.68,55.36 88.77,56.26 v88.77,57.28 88.87,57.37 U12.2 | v89.53,63.88 89.92,64.26 89.92,64.79 R10.2
  Bottom 0.254: v89.53,63.88 88.77,63.12 v88.77,57.28
AUDIO-MIX-AC  (1 unrouted)
  Top 0.254: J2.2B R22.2
AUDIO-MIX-DC  (via drill 0.3 pad 0.56)
  Top 0.254: U12.3 91.33,58.02 91.68,57.67 R14.2 91.68,51.45 94.23,48.9 103.5,48.9 v103.63,48.77 | v109.09,18.16 108.58,17.65 102.49,17.65 100.71,19.43 87.38,19.43 87,19.81 85.72,19.81 85.34,19.43 74.8,19.43 74.3,19.94 68.85,19.94 63.75,14.84 R22.1
  Bottom 0.254: v103.63,48.77 103.63,46.86 109.22,41.27 109.22,18.29 v109.09,18.16
CARTCLK  (via drill 0.3 pad 0.51)
  Top 0.254: v17.78,75.56 35.56,75.56 38.15,72.97 38.15,70.43 38.47,70.12 R3.1
  Bottom 0.254: H1.37 18.48,89.73 17.91,89.15 17.91,75.69 v17.78,75.56
CC1
  Top 0.254: J4.A5 87.77,8.1 87.11,8.76 R23.2
CC2
  Top 0.254: J4.B5 88.77,8.1 89.42,8.76 R24.2
CIC
  Top 0.254: H1.71 102.66,91.48 101.47,90.3 101.47,87.76 102.74,86.49 102.74,85.72 105.79,82.68 108.08,82.68 108.95,81.8 R1.2 108.9,81.48 U4.4
CICRST
  Top 0.254: R1.1 106.17,81.53 102.23,85.47 102.23,86.23 100.97,87.5 100.97,91.47 H1.70
CLK0
  Top 0.254: U7.4 52.39,75.88 52.7,75.56 R4.2
CLK1
  Top 0.254: U7.1 54.31,73.98 55.24,73.04 R5.2
CLK2
  Top 0.254: U7.6 51.1,73.98 50.16,73.04 R3.2
CLK5X
  Top 0.254: U3.5 71.12,80.22 71.88,79.45 71.88,73.86 71.38,73.36 U10.1
CLK5X/2
  Top 0.254: U10.5 73.7,71.42 71.21,68.92 U11.1
CLK-FIN
  Top 0.254: U7.3 53.79,75.88 52.58,77.09 52.58,80.39 52.2,80.77 52.2,82.68 51.94,82.93 45.97,82.93 44.45,81.41 44.45,79.25 45.34,78.36 S1.ACOM
CLK-NTSC
  Top 0.254: U8.5 42.97,73.22 43.69,73.93 43.69,75.99 42.84,76.84 S1.AB
CLK-PAL
  Top 0.254: U2.5 49.72,77.79 49.02,77.09 S1.AA
CLKIN
  Top 0.254: U3.1 64.34,75.74 62.99,77.09 S2.BB
CLKVCC  (via drill 0.3, 0.3 pad 0.51)
  Top 0.254: S2.ACOM 59.05,79.88 59.82,79.12 63.01,79.12 63.63,79.74 C4.2 68.58,79.74 | 68.58,79.74 69.45,79.74 69.85,80.14 U3.6 | U3.7 68.58,79.76 68.58,79.74 | 68.58,79.74 U3.2 v68.58,74.17 | U10.8 75.56,73.36 | 75.56,73.36 76.73,73.36 C7.1 | U11.8 75.56,68.92 | 75.56,68.92 76.81,68.92 C9.1 78.09,68.94 78.36,69.22 78.36,72.9 77.99,73.26 C7.1 | U10.6 75.37,72.06 75.56,72.26 75.56,72.72 | 75.56,72.72 75.56,73.36 | U10.7 75.56,72.72 | U11.6 75.37,67.62 75.56,67.82 75.56,68.27 | U11.7 75.56,68.27 | C7.1 76.83,74.3 76.45,74.68 v73.15,74.68 | 75.56,68.27 75.56,68.92
  Bottom 0.254: v73.15,74.68 72.64,74.17 v68.58,74.17
CN
  Top 0.254: U12.7 87.08,60.62 86.47,61.23 C11.1
CP
  Top 0.254: U12.8 84.38,62.64 C11.2
CPUCLK  (via drill 0.3)
  Top 0.254: U11.5 73.52,66.97 71.83,65.28 67.06,65.28 66.55,64.77 65.28,64.77 v64.77,64.26 64.26,64.77 62.23,64.77 61.72,65.28 61.09,65.28 57.02,69.34 57.02,75.06 56.55,75.53 S2.BA | v64.77,55.88 v40.64,55.88
  Bottom 0.254: U14.29 v40.64,55.88 | v64.77,64.26 v64.77,55.88
CPUCLK-SW
  Top 0.254: S2.BCOM 59.05,77.6 58.29,78.36 55.88,78.36 55.63,78.11 55.63,75.69 56.52,74.8 56.52,71.37 56.26,71.12 54.36,71.12 53.98,70.74 53.98,70.39 53.7,70.12 R4.1
D0  (via drill 0.3 pad 0.51)
  Top 0.254: U14.28 40.39,45.97 55.5,45.97 v56.13,45.34 | v71.12,46.1 71.25,46.23 72.01,46.23 72.26,45.97 77.85,45.97 78.87,44.96 84.45,44.96 85.72,43.69 86.36,43.69 88.65,41.4 90.42,41.4 90.93,40.89 92.71,40.89 93.22,40.39 95,40.39 95.5,39.88 97.28,39.88 97.79,39.37 99.57,39.37 100.08,38.86 100.84,38.86 U16.2 | v36.83,72.14 36.83,72.26 35.05,74.04 33.66,74.04 32.38,72.77 U5.11 | v38.23,81.53 37.97,81.79 37.97,82.8 37.72,83.06 37.72,87.76 38.73,88.77 39.75,88.77 40.26,89.28 42.04,89.28 42.55,89.79 44.32,89.79 44.83,90.3 47.3,90.3 H1.49 | v19.05,18.41 U17.18 | v24.13,26.04 U17.9 | v24.38,31.11 24.51,31.24 33.66,31.24 33.91,31.5 35.43,31.5 v35.81,31.88
  Bottom 0.254: v71.12,46.1 70.99,45.97 62.74,45.97 62.23,45.47 58.17,45.47 57.91,45.21 57.4,45.21 57.28,45.34 v56.13,45.34 | v38.23,81.53 38.99,80.77 38.99,75.95 36.83,73.79 v36.83,72.14 36.2,71.5 36.2,66.17 37.59,64.77 38.61,64.77 39.37,64.01 39.37,62.99 38.1,61.72 U14.28 36.07,46.23 36.07,32.13 v35.81,31.88 | v19.05,18.41 19.05,19.18 17.4,20.83 17.4,24.26 18.29,25.15 20.07,25.15 20.83,24.38 23.37,24.38 24.26,25.27 24.26,25.91 v24.13,26.04 24.26,26.16 24.26,30.99 v24.38,31.11
D1  (via drill 0.3 pad 0.51)
  Top 0.254: v35.56,72.52 35.56,72.77 34.8,73.53 33.91,73.53 33.66,73.28 U5.12 | v37.72,80.26 37.47,80.52 37.47,82.55 37.21,82.8 37.21,88.01 38.48,89.28 39.5,89.28 40.01,89.79 41.78,89.79 42.29,90.3 44.07,90.3 44.58,90.81 45.3,90.81 H1.48 | U14.27 36.32,47.5 37.08,47.5 37.59,46.99 38.61,46.99 40.13,45.47 54.74,45.47 v55.5,44.7 | U16.3 98.3,38.86 97.54,38.86 97.03,39.37 95.25,39.37 94.74,39.88 92.96,39.88 92.46,40.39 90.68,40.39 90.17,40.89 88.39,40.89 86.11,43.18 85.47,43.18 84.2,44.45 78.61,44.45 77.6,45.47 71.88,45.47 v71.75,45.59 | v35.81,30.99 34.16,30.99 33.91,30.73 25.15,30.73 v24.89,30.48 | U17.12 18.29,26.04 v19.94,24.38 | U17.3 v21.59,18.41
  Bottom 0.254: v37.72,80.26 37.97,80.01 37.97,76.45 35.56,74.04 v35.56,72.52 35.18,72.14 35.18,65.66 36.83,64.01 36.83,62.99 35.56,61.72 U14.27 35.56,32.51 35.18,32.13 35.18,31.62 v35.81,30.99 | v24.89,30.48 24.77,30.35 24.77,25.02 23.62,23.88 20.45,23.88 v19.94,24.38 19.68,24.64 18.54,24.64 17.91,24 17.91,21.08 20.57,18.41 v21.59,18.41 | v55.5,44.7 58.17,44.7 58.42,44.96 62.48,44.96 62.99,45.47 71.63,45.47 v71.75,45.59
D1-PULLUP  (via drill 0.3 pad 0.51)
  Top 0.254: U17.17 19.05,19.68 19.68,20.32 26.67,20.32 27.05,20.7 v27.05,21.46 | U17.8 v27.05,24.77 | v31.75,35.05 R16.1
  Bottom 0.254: v27.05,21.46 v27.05,24.77 27.05,28.57 28.19,29.72 28.19,33.15 30.1,35.05 v31.75,35.05
D2  (via drill 0.3 pad 0.51)
  Top 0.254: v34.29,72.9 34.67,72.9 34.92,72.64 U5.13 | v36.83,79.38 36.96,79.5 36.96,82.3 36.7,82.55 36.7,88.27 38.23,89.79 39.24,89.79 39.75,90.3 41.53,90.3 42.04,90.81 42.8,90.81 H1.47 | U14.26 33.78,47.5 34.54,47.5 35.05,46.99 36.83,46.99 37.34,46.48 38.35,46.48 39.88,44.96 54.36,44.96 55.37,43.94 56.64,43.94 59.18,46.48 69.72,46.48 71.25,44.96 77.34,44.96 78.36,43.94 83.95,43.94 85.22,42.67 85.85,42.67 88.14,40.39 89.92,40.39 90.42,39.88 92.2,39.88 92.71,39.37 94.49,39.37 95,38.86 95.76,38.86 U16.4
  Bottom 0.254: U14.26 33.02,61.72 34.29,62.99 34.29,65.02 34.16,65.15 34.16,72.77 v34.29,72.9 34.29,74.3 36.96,76.96 36.96,79.25 v36.83,79.38
D3  (via drill 0.3 pad 0.51)
  Top 0.254: v35.81,78.61 36.2,78.99 U5.15 36.2,88.52 37.97,90.3 38.99,90.3 39.5,90.81 40.3,90.81 H1.46 | U14.25 31.24,47.5 32,47.5 32.51,46.99 34.29,46.99 34.8,46.48 36.58,46.48 37.08,45.97 38.1,45.97 39.62,44.45 54.1,44.45 55.12,43.43 56.9,43.43 59.44,45.97 69.47,45.97 70.99,44.45 77.09,44.45 78.11,43.43 83.69,43.43 84.96,42.16 85.6,42.16 87.88,39.88 89.66,39.88 90.17,39.37 91.95,39.37 92.46,38.86 93.22,38.86 U16.5 | v19.05,20.95 U17.16 | v24.13,23.5 U17.7 | v25.4,29.84 25.78,30.23 34.16,30.23 34.42,30.48 35.18,30.48 v35.31,30.35
  Bottom 0.254: v35.81,78.61 35.81,77.34 33.15,74.68 33.15,66.42 31.75,65.02 31.75,62.99 30.48,61.72 U14.25 31.24,47.5 32,47.5 32.51,46.99 34.29,46.99 35.05,46.23 35.05,32.7 34.67,32.32 34.67,30.99 v35.31,30.35 | v19.05,20.95 18.8,20.95 18.41,21.34 18.41,23.75 18.8,24.13 19.3,24.13 20.07,23.37 24,23.37 v24.13,23.5 25.27,24.64 25.27,29.72 v25.4,29.84
D4  (via drill 0.3 pad 0.51)
  Top 0.254: v34.67,79.25 34.92,79.5 U5.16 34.92,82.3 35.69,83.06 35.69,88.69 H1.45 | U14.24 28.7,47.5 29.46,47.5 29.97,46.99 31.75,46.99 32.26,46.48 34.04,46.48 34.54,45.97 36.32,45.97 36.83,45.47 37.85,45.47 39.37,43.94 53.85,43.94 54.86,42.93 57.15,42.93 59.69,45.47 69.22,45.47 70.74,43.94 76.83,43.94 77.85,42.93 83.44,42.93 84.71,41.66 85.34,41.66 87.63,39.37 89.41,39.37 89.92,38.86 90.68,38.86 U16.6 | v19.05,23.5 U17.14 | v24.13,20.95 U17.5 | v26.04,29.34 26.42,29.72 34.54,29.72 v34.67,29.84
  Bottom 0.254: v34.67,79.25 34.67,77.72 32.13,75.18 32.13,66.93 29.21,64.01 29.21,62.99 27.94,61.72 U14.24 28.7,48.26 29.97,46.99 31.75,46.99 32.26,46.48 34.04,46.48 34.54,45.97 34.54,32.89 34.16,32.51 34.16,30.35 v34.67,29.84 | v19.05,23.5 19.68,22.86 23.5,22.86 | 23.5,22.86 23.5,21.59 v24.13,20.95 | 23.5,22.86 24.38,22.86 25.78,24.26 25.78,29.08 v26.04,29.34
D5  (via drill 0.3 pad 0.51)
  Top 0.254: v33.53,78.36 33.53,79.76 33.66,79.88 U5.17 33.66,82.3 35.18,83.82 35.18,88.9 35.98,89.7 H1.44 | U14.23 26.16,47.5 26.92,47.5 27.43,46.99 29.21,46.99 29.72,46.48 31.5,46.48 32,45.97 33.78,45.97 34.29,45.47 36.07,45.47 36.58,44.96 37.59,44.96 39.12,43.43 53.59,43.43 54.61,42.42 57.4,42.42 59.94,44.96 68.96,44.96 70.48,43.43 76.58,43.43 77.6,42.42 83.19,42.42 84.45,41.15 85.09,41.15 87.38,38.86 88.14,38.86 U16.7
  Bottom 0.254: U14.23 25.4,61.72 26.67,62.99 26.67,64.01 27.43,64.77 28.45,64.77 31.11,67.44 31.11,75.69 33.53,78.11 v33.53,78.36
D6  (via drill 0.3 pad 0.51)
  Top 0.254: U16.8 86.36,38.99 84.71,40.64 84.2,40.64 82.93,41.91 77.34,41.91 76.33,42.93 70.23,42.93 68.71,44.45 60.2,44.45 57.66,41.91 54.36,41.91 53.34,42.93 38.86,42.93 37.34,44.45 36.32,44.45 35.81,44.96 34.04,44.96 33.53,45.47 31.75,45.47 31.24,45.97 29.46,45.97 28.96,46.48 27.18,46.48 26.67,46.99 24.89,46.99 24.38,47.5 23.62,47.5 U14.22 | v32.38,79.25 U5.18 32.38,82.3 34.67,84.58 34.67,88.52 33.48,89.71 H1.43
  Bottom 0.254: U14.22 22.86,61.72 24.13,62.99 24.13,64.01 24.89,64.77 25.91,64.77 26.92,65.79 27.94,65.79 30.1,67.94 30.1,76.2 32.38,78.49 v32.38,79.25
D7  (via drill 0.3 pad 0.51)
  Top 0.254: U16.9 83.82,40.26 82.68,41.4 77.09,41.4 76.07,42.42 69.98,42.42 68.45,43.94 60.45,43.94 57.91,41.4 54.1,41.4 53.09,42.42 38.61,42.42 37.08,43.94 36.07,43.94 35.56,44.45 33.78,44.45 33.27,44.96 31.5,44.96 30.99,45.47 29.21,45.47 28.7,45.97 26.92,45.97 26.42,46.48 24.64,46.48 24.13,46.99 22.35,46.99 21.84,47.5 21.08,47.5 U14.21 | v31.11,79.25 U5.19 31.11,82.3 34.16,85.34 34.16,88.3 H1.42
  Bottom 0.254: U14.21 20.32,61.72 21.59,62.99 21.59,64.01 22.35,64.77 24.13,64.77 24.64,65.28 25.65,65.28 26.67,66.29 27.69,66.29 29.59,68.2 29.59,76.45 31.11,77.98 v31.11,79.25
DQ1
  Top 0.254: U10.2 71.05,72.72 71.25,72.52 71.25,72.26 71.05,72.06 U10.3
DQ2
  Top 0.254: U11.2 71.05,68.27 71.25,68.07 71.25,67.82 71.05,67.62 U11.3
EXP6  (via drill 0.3, 0.3 pad 0.56)
  Top 0.254: H1.54 62.72,93.22 73.53,93.22 74.74,92.01 74.74,91 75.44,90.3 76.45,90.3 77.22,89.53 v77.22,88.65 | v82.04,52.7 87.25,52.7 87.64,53.1 C16.1
  Bottom 0.254: v77.22,88.65 79.12,88.65 80.77,87 80.77,63.88 81.92,62.74 81.92,52.83 v82.04,52.7
EXP6-1
  Top 0.254: C16.2 82.66,54.48 R13.1
EXP6-2
  Top 0.254: U12.13 82.9,57.37 82.44,56.91 R12.1 81.92,56.91 80.53,55.53 R13.2
EXP6-AC
  Top 0.254: C27.2 74.28,14.59 72.52,12.83 72.52,8.13 75.18,5.46 78.14,5.46 J3.4
EXP6-DC  (via drill 0.3 pad 0.51, 0.3 pad 0.56)
  Top 0.254: R12.2 82.44,58.91 83.33,58.02 U12.12 84.39,58.04 v85.47,58.04 | v103,48.26 102.87,48.39 93.98,48.39 91.57,50.8 85.72,50.8 v85.47,51.05 85.22,50.8 74.17,50.8 67.06,57.91 59.82,57.91 v59.69,57.78 | v108.33,18.41 108.08,18.16 102.74,18.16 100.97,19.94 87.63,19.94 87.25,20.32 85.47,20.32 85.09,19.94 75.18,19.94 v75.06,20.07 | C27.1 v75.06,16.64
  Bottom 0.254: v85.47,58.04 v85.47,51.05 | v103,48.26 103.12,48.13 103.12,46.61 108.71,41.02 108.71,18.8 v108.33,18.41 | v75.06,20.07 v75.06,16.64 | v59.69,57.78 59.69,75.69 63.25,79.25 P1.3
EXP6-MIX  (via drill 0.3 pad 0.51)
  Top 0.254: v59.05,58.29 59.18,58.42 67.31,58.42 74.42,51.31 83.31,51.31 v83.44,51.44 | R11.1 83.33,64.12 v83.44,64.01
  Bottom 0.254: P1.2 61.91,78.67 59.18,75.95 59.18,66.04 57.15,64.01 57.15,62.99 59.18,60.96 59.18,58.42 v59.05,58.29 | v83.44,64.01 v83.44,51.44
EXT3  (via drill 0.3 pad 0.51)
  Top 0.254: v48.13,29.08 49.78,29.08 51.56,30.86 53.34,30.86 57.02,34.54 61.59,34.54 63.5,36.45 U16.17 61.85,39.75 61.85,40.21 R25.2
  Bottom 0.254: v48.13,29.08 48.13,26.67 39.88,18.41 RGB.EXT3
G1-2Y1
  Top 0.254: U15.1 28.57,37.34 27.43,36.2 20.45,36.2 18.92,34.67 18.92,31.5 19.3,31.11 21.97,31.11 22.23,31.37 U15.11
GND  (via drill 0.3, 0.3 pad 0.51)
  Top 0.254: DA3.6 34.56,22.21 v34.47,22.3 | DA1.6 34.81,26.02 v34.54,26.29
  other vias: 110.49,2.67 105.92,1.27 110.49,5.21 110.49,7.87 110.49,10.16 110.49,12.7 110.49,15.24 110.49,17.78 110.49,20.32 110.49,22.86 110.49,25.4 110.49,27.81 110.49,30.48 110.49,32.64 110.49,35.31 110.49,37.97 110.49,40.64 110.49,43.18 110.49,45.72 110.49,48.26 110.49,50.8 110.49,53.34 110.49,55.88 110.49,58.42 110.49,60.96 110.49,63.5 110.49,66.04 110.49,68.58 110.49,71.12 110.49,73.66 110.49,76.2 110.49,78.99 110.49,81.41 105.41,102.87 102.87,102.87 100.33,102.87 97.79,102.87 95.25,102.87 92.71,102.87 90.17,102.87 87.63,102.87 85.09,102.87 82.55,102.87 80.01,102.87 77.47,102.87 74.93,102.87 72.39,102.87 69.85,102.87 67.31,102.87 64.77,102.87 62.23,102.87 59.69,102.87 57.15,102.87 54.61,102.87 52.07,102.87 49.53,102.87 46.99,102.87 44.45,102.87 41.91,102.87 39.37,102.87 36.83,102.87 34.29,102.87 31.75,102.87 29.21,102.87 26.67,102.87 24.13,102.87 21.59,102.87 19.05,102.87 13.97,81.28 13.97,78.74 13.97,76.2 13.97,73.66 13.97,71.12 13.97,68.58 13.97,66.04 13.97,63.5 13.97,60.96 13.97,58.42 17.78,1.27 20.07,1.27 22.23,1.27 25.78,1.27 27.94,1.27 30.23,1.27 33.02,1.27 35.56,1.27 37.97,1.27 40.39,1.27 72.77,1.14 109.09,1.27 15.24,1.27 23.45,89.25 27.3,84.45 24.26,84.33 22.23,79.38 28.57,78.36 25.4,79.38 19.68,78.11 19.68,74.42 20.32,71.63 20.32,68.58 28.19,74.04 28.07,71.88 24.13,73.41 19.68,66.8 18.41,59.82 18.41,50.16 18.03,55.24 20.32,40.26 23.37,30.23 19.81,21.72 22.73,21.21 30.35,11.43 27.3,34.29 29.84,39.37 28.19,44.96 27.94,41.91 32.38,44.2 50.95,94 51.31,88.65 32.26,88.14 38.86,87.38 33.02,86.36 30.95,89.5 39.24,82.68 38.86,69.22 72.39,85.09 59.7,90.25 54.7,90.25 57.2,94 62.2,94 67.2,94 20.95,94 25.95,94 33.45,94 40.95,94 48.45,94 75.69,88.39 75.95,94 83.45,94 90.95,94 98.45,94 23.45,94 28.45,94 30.95,94 35.95,94 38.45,94 43.45,94 45.95,94 70.95,94 73.45,94 78.45,94 80.95,94 85.95,94 88.45,94 93.45,94 95.95,94 86.36,87 90.19,89.75 95.25,87 94.61,82.55 90.81,82.55 100.95,94 90.81,78.74 94.61,78.74 87.63,78.74 98.42,74.04 105.79,80.64 105.16,72.64 102.74,75.44 105.92,67.31 106.05,58.93 78.68,78.11 88.9,72.01 93.73,65.15 71.12,52.07 63.5,59.69 63.5,50.16 69.09,54.74 104.14,53.98 96.14,42.29 103.38,40.39 89.53,43.31 80.39,46.86 54.61,61.59 60.96,60.33 60.96,50.16 54.61,50.16 48.77,60.33 48.77,50.16 45.21,59.82 45.21,50.16 39.37,59.82 39.37,50.16 87,81.92 57.53,86.36 101.47,43.18 46.35,28.57 41.53,21.34 44.58,24.77 18.45,94 103.45,94 102.62,35.81 102.87,27.3 106.55,27.18 106.17,21.97 87.63,24.77 90.17,24.77 92.71,24.77 95.25,24.77 97.79,24.77 100.33,24.77 102.87,24.77 97.79,36.07 100.33,35.56 21.45,89.75 86.23,72.14 20.57,45.97 27.3,36.96 23.5,36.96 22.23,34.29 21.08,16.26 25.15,11.3 105.16,29.46 107.31,53.34 50.16,1.27 54.99,1.27 46.35,1.27 61.59,1.27 65.41,1.27 82.55,1.52 96.52,1.27 102.87,1.27 100.71,1.27 98.68,1.27 103,3.81 104.7,97.75 102.2,97.75 99.7,97.75 97.2,97.75 94.7,97.75 92.2,97.75 89.7,97.75 87.2,97.75 84.7,97.75 82.2,97.75 79.7,97.75 77.2,97.75 74.93,97.79 72.2,97.75 69.7,97.75 67.2,97.75 64.7,97.75 62.2,97.75 59.7,97.75 57.2,97.75 54.7,97.75 52.2,97.75 49.7,97.75 47.2,97.75 44.7,97.75 42.2,97.75 39.7,97.75 37.2,97.75 34.7,97.75 32.2,97.75 29.7,97.75 27.2,97.75 24.7,97.75 22.2,97.75 107.2,97.75 105.95,94 64.7,94 59.7,94 54.7,94 57.2,90.25 62.2,90.25 64.7,90.25 19.7,97.75 26.04,88.77 68.58,88.65 98.93,84.2 16.51,102.87 13.97,102.87 107.95,102.87 110.49,102.87 13.97,83.82 13.97,86.36 13.97,88.9 13.97,91.44 13.97,93.98 13.97,96.52 13.97,99.06 13.97,100.97 110.49,83.82 110.49,86.36 110.49,88.9 110.49,91.44 110.49,93.98 110.49,96.52 110.49,99.06 110.49,100.97 17.16,97.75 22.61,82.8 19.3,82.8 19.3,88.39 19.3,85.6 22.1,86.36 41.66,87.12 105.66,88.39 25.91,86.36 38.61,84.96 49.78,87.25 90.68,86.36 96.39,3.68 79.63,1.14 71.37,63.25 36.83,59.82 34.29,59.82 31.75,59.82 29.21,59.82 36.83,50.16 34.29,50.16 31.75,50.16 29.21,50.16 41.91,59.82 41.91,50.16 27.3,59.82 26.04,59.82 24.77,59.82 23.5,59.82 22.23,59.82 20.95,59.82 27.3,50.16 26.04,50.16 24.77,50.16 23.5,50.16 22.23,50.16 20.95,50.16 19.68,59.82 19.68,50.16 23.5,45.97 22.61,40.39 52.07,50.16 52.07,60.33 29.59,82.55 33.78,10.16 36.83,9.53 46.74,38.73 48.26,36.58 51.82,36.2 52.32,40.89 57.91,70.48 61.47,66.17 57.78,66.04 50.67,67.18 51.44,71.12 54.1,66.67 57.91,75.82 55.63,74.17 60.58,83.06 57.78,79.25 62.74,83.06 67.18,86.61 70.74,79.5 70.48,83.31 70.48,77.34 66.93,77.72 63.12,77.98 62.87,75.56 69.47,70.23 67.56,74.04 61.09,72.9 67.69,66.04 72.52,67.94 78.68,74.74 73.41,65.66 53.98,69.09 55.12,79.5 66.17,81.15 72.77,72.52 73.03,80.9 66.55,83.06 13.97,56.01 13.97,53.59 13.97,50.8 13.97,48.26 13.97,45.72 26.42,14.35 28.7,13.34 30.35,7.62 27.18,6.22 25.02,6.22 23.11,5.97 23.5,27.56 36.83,33.02 42.8,30.99 36.45,30.35 36.96,38.73 33.66,38.73 33.78,33.78 30.35,36.45 19.18,29.34 16.13,29.21 17.14,33.15 18.29,38.61 37.21,41.78 33.53,41.91 36.96,35.81 40.26,39.12 45.72,32.51 100.84,3.94 94.61,18.8 99.82,10.29 99.82,13.46 107.76,58.93 107.76,63.75 107.76,73.91 107.76,68.01 105.6,76.64 107.95,80.26 108.9,77.98 105.79,84.26 108.08,83.76 102.62,89.98 103.63,86.17 100.33,27.43 98.04,27.43 95.38,27.3 92.84,27.56 87.63,26.92 23.75,66.17 17.14,77.91 16.51,75.56 85.72,1.27 90.81,1.27 14.1,42.67 14.1,39.88 14.1,37.08 12.95,24 12.95,22.1 12.95,20.07 12.95,18.03 12.95,16 12.95,14.22 14.61,9.91 14.61,3.81 15.88,5.97 14.61,7.87 14.61,11.94 17.4,43.81 18.35,62.36 96.65,76.58 41.91,62.48 44.45,62.48 32.64,11.43 32.77,6.35 59.69,24 57.53,24.64 59.31,27.56 105.54,9.91 102.62,6.6 100.2,6.73 97.03,9.14 96.9,7.24 59.56,8.76 67.06,8.64 74.17,8.51 77.98,9.4 102.87,9.78 103.89,14.1 71.5,55.5 23.11,11.3 21.08,11.3 19.18,14.99 19.3,17.53 22.61,17.53 83.82,10.03 92.58,7.49 85.47,4.06 91.06,4.19 93.85,1.02 93.47,3.17 33.27,19.43 32.44,14.17 22.86,13.34 38.1,27.3 38.1,23.5 39.88,24.77 37.97,25.02 33.27,15.75 30.61,27.56 27.69,28.32 33.6,23.44 95.63,11.43 106.55,14.73 105.79,5.84 45.09,27.69 91.69,59.05 87.88,58.29 89.53,61.47 87.5,61.47 87.5,63.88 87.12,66.55 87,69.85 84.33,66.55 84.33,69.09 82.42,72.14 78.68,68.26 78.68,63.82 79.57,61.79 79.69,59.5 79.69,52.01 88.77,47.24 84.52,51.75 86.42,51.63 90.61,55.82 92.39,55.94 88.58,52.77 90.36,51.5 86.42,53.91 84.39,55.94 86.42,57.34 89.53,68.58 91.69,64.26 97.28,49.91 99.95,51.18 64.77,21.72 67.44,19.68 63.25,16.64 65.41,17.78 64.52,10.79 62.48,10.79 61.47,13.21 76.83,12.7 75.06,15.75 78.61,15.75 74.04,18.92 80.39,18.67 85.09,11.94 91.82,18.8 90.81,13.97 87.88,17.14 84.84,17.14 72.64,5.71 70.48,9.91 108.84,14.99 103.5,16.51 101.73,17.4 101.73,15.24 97.28,14.86 102.87,21.72 72.39,21.72 74.93,21.72 77.47,21.72 80.01,21.72 82.55,21.97 90.17,21.72 92.71,21.72 95.25,21.72 97.79,21.72 100.33,21.72 14.61,26.16 14.61,28.19 14.61,30.23 14.61,32.26 14.61,34.29 15.62,20.07 15.62,18.03 15.62,24.13 16.13,25.91 23.24,19.3 18.16,13.46 65.41,13.46 44.45,3.94 52.07,3.94 59.82,3.94 67.06,3.81 80.64,5.59 52.45,54.99 52.45,56.77 48.39,56.77 48.39,54.99 45.59,54.99 45.59,56.77 54.23,56.77 54.23,54.99 61.34,54.99 61.34,56.77 63.12,56.77 63.12,54.99 65.79,59.69 57.91,56.77 57.91,54.99 41.53,54.99 99.57,17.4 76.83,18.67 19.68,76.2 28.19,76.2 64.7,92.48 67.24,92.48 82.17,15.75 80.52,12.57 83.06,13.21 84.84,14.61 77.09,4.45 87.88,14.61 41.53,56.77 57.91,50.16 58.17,60.45 67.31,50.16 69.34,59.82 71.37,58.8 24.38,13.34 27.05,10.92 20.45,19.56 31.75,33.78 29.59,33.4 22.99,25.15 20.95,25.27 21.46,27.3 33.66,36.58 30.48,14.1 50.16,32 28.7,16.13 32.51,17.27 27.05,18.41 28.57,20.19 101.47,65.41 103,62.23 99.69,60.96 104.01,59.82 103.12,57.28 103,55.88 99.64,53.42 99.01,57.48 96.72,57.48 99.77,62.31 92.33,61.21 103,60.96 98.68,79.38 90.42,9.02 86.11,9.02 88.27,3.17 61.47,17.27 69.09,73.41 60.33,78.23 60.33,80.01 62.74,80.01 49.15,73.28 48.9,71.12 51.44,73.03 53.98,73.03 51.44,69.09 49.28,68.96 50.29,75.82 48.9,76.45 49.02,78.74 53.85,76.83 53.21,80.52 53.21,83.31 56.52,83.31 49.66,81.15 48.9,83.62 42.29,69.47 37.47,70.74 40.01,72.26 38.86,73.53 39.75,74.8 42.04,72.26 41.53,74.3 41.02,77.85 42.29,81.92 40.39,80.01 42.16,84.58 52.2,76.58 60.71,11.18 58.8,21.46 52.07,24.77 50.16,25.02 49.66,28.32 53.85,30.35 49.66,26.85 54.36,33.53 53.98,35.94 61.47,33.91 63.12,35.18 57.02,35.56 57.28,33.91 59.69,35.56 60.83,30.35 57.53,28.83 57.4,26.87 61.98,27.69 61.85,24.13 64.39,25.02 64.39,31.24 58.93,30.23 56.13,32.77 65.91,32.77 67.31,34.16 68.71,35.43 70.87,35.94 72.64,36.58 72.77,39.5 70.99,40.26 58.17,40.13 52.07,46.99 49.53,46.99 47.24,46.86 41.66,46.86 46.74,41.02 41.02,41.02 48.39,40.13 69.6,27.05 69.85,21.72 68.07,12.06 72.26,32.77 69.09,29.34 69.85,32 66.67,29.46 64.14,27.69 82.68,46.86 87.88,44.83 85.22,46.74 99.57,41.4 62.23,21.72 61.47,19.18 61.47,15.37 69.22,19.18 65.79,15.88 67.44,27.56 95.76,36.07 95.63,34.8 95.5,32.51 92.71,34.16 90.17,33.91 90.3,36.32 92.84,36.32 87.76,36.32 85.47,36.96 100.84,30.86 100.33,33.53 97.79,29.08 95.25,29.08 74.68,29.72 74.04,36.45 74.04,34.42 87.63,33.91 98.17,34.04 105.16,35.94 102.62,29.46 102.62,32.64 105.16,32.64 62.23,36.7 59.44,33.91 64.14,36.2 53.98,26.92 53.98,28.19 62.74,30.35 54.99,31.62 64.64,29.59 60.45,20.7 47.12,26.85 59.31,10.29 74.93,27.18 77.47,26.8 80.52,26.67 87.63,28.45 85.09,27.05 72.39,23.88 73.03,26.92 73.15,28.96 76.96,28.83 80.64,29.97 81.92,28.83 79.76,27.94 84.58,28.83 87.63,30.35 90.17,30.35 89.53,26.92 90.81,26.92 85.72,30.86 84.45,30.86 83.19,28.83 82.55,26.54 83.19,32.26 81.92,32.26 79.38,29.59 80.01,32.64 82.55,34.42 85.09,33.91 85.47,25.53 74.55,25.53 76.83,31.11 62.56,42.04 64.44,42.04 66.34,42.04 68.45,42.04 69.09,40.77 60.71,41.27 60.71,39.62 54.74,40.13 67.31,21.72 85.09,23.88 82.55,23.88 80.01,23.88 77.47,23.88 74.55,24 57.66,10.29 56.13,11.05 54.86,13.21 52.83,17.53 53.59,17.53 54.61,15.37 54.36,10.92 54.23,9.4 50.93,7.24 52.96,8.13 49.66,5.84 46.86,5.84 45.59,7.24 43.56,7.24 41.78,8.51 40.13,10.16 38.86,11.18 36.83,11.56 36.2,14.61 36.7,17.14 39.5,17.14 37.97,20.19 40.01,14.73 41.27,12.95 43.05,11.05 49.53,12.19 49.53,11.43 48.77,11.43 48.77,12.19 48.01,11.43 52.83,16.76 53.59,16.76 54.36,17.53 43.05,12.95 43.05,15.62 43.05,18.16 43.05,20.57 44.32,21.59 46.35,21.72 48.13,21.72 49.4,23.11 47.62,25.02 41.27,18.8 45.85,23.37 40.01,20.07 56.39,7.62 55.75,4.45 90.04,18.8 91.95,16.26 94.49,16.26 94.87,13.84 94.23,9.14 95.63,4.95 94.11,6.1 96.9,18.8 105.16,20.45 105.16,15.88 104.14,12.32 105.79,12.32 108.84,16.76 106.93,24 106.93,31.75 106.93,35.18 106.93,37.85 104.78,42.42 102.49,44.7 101.09,46.35 99.19,46.61 95.5,46.61 90.04,49.02 81.41,49.02 87.5,49.02 84.58,49.02 79.76,49.02 72.77,49.28 69.85,49.15 72.77,47.37 69.85,47.37 67.31,47.24 103.89,50.04 108.97,42.67 106.93,40.26 95.5,44.58 66.67,56.9 69.6,57.28 43.81,41.02 85.09,22.1 87.63,22.1 84.07,18.67 87.88,18.67 100.46,18.8 103.12,20.19 105.16,25.53 106.93,29.21 35.81,19.43 84.33,7.24 102.49,12.7 65.15,47.12 59.69,47.62 39.88,30.1
  pour Top (isolate 0.203, rank 2): 0,104.14 124.46,104.14 124.46,0 0,0
  pour Bottom (isolate 0.203, rank 2): 0,104.14 124.46,104.14 124.46,0 0,0
GND-CAP
  Top 0.254: U12.6 91.09,59.97 91.31,60.2 91.31,61.71 90.53,62.48 C12.2
LEDA
  Top 0.254: R20.1 98.55,16.37 D1.A
LEDK  (via drill 0.3)
  Top 0.254: U18.4 105.86,16.82 v106.05,16.64
  Bottom 0.254: v106.05,16.64 106.05,15.24 102.74,11.94 D1.K
M2  (via drill 0.3 pad 0.51)
  Top 0.254: v46.35,60.83 46.23,60.96 v17.14,60.96 | v39.37,39.5 39.24,39.62 32.38,39.62 27.94,35.18 26.92,35.18 26.04,34.29 U15.14
  Bottom 0.254: v46.35,60.83 46.48,60.71 46.48,49.02 U14.31 39.37,41.91 v39.37,39.5 | v17.14,60.96 17.14,74.04 18.41,75.31 18.41,88.92 H1.38
OUT0  (via drill 0.3 pad 0.51)
  Top 0.254: v22.23,14.35 22.99,15.11 26.54,15.11 29.55,18.12 DA5.3 31.11,19.56 31.75,20.19 33.4,20.19 33.78,20.57 36.96,20.57 37.34,20.95 38.86,20.95 v38.99,20.83 | C20.2 47.77,31 v47.5,30.73 47.24,30.99 R18.1
  Bottom 0.254: U14.39 65.28,48.26 64.01,46.99 62.23,46.99 61.72,46.48 57.4,46.48 56.9,45.97 55.88,45.97 51.18,41.27 51.18,34.67 47.5,30.99 v47.5,30.73 47.24,30.73 44.96,28.45 44.45,28.45 44.2,28.7 42.29,28.7 41.78,28.19 41.78,23.75 38.99,20.95 v38.99,20.83 | H6.3 H5.3 22.13,14.26 v22.23,14.35
P1-D0  (via drill 0.3 pad 0.51)
  Top 0.254: v23.5,17.14 U17.2 27.05,17.14 31.5,21.59 RA1.1 33.4,21.59 33.91,21.08 36.7,21.08 37.12,21.5 DA3.1 38.59,22.21 39.24,22.86 DA4.5 | H5.4 24.13,8.76 23.26,7.89 17.14,7.89 16.38,8.65 16.38,10.43 15.88,10.94 C34.2
  Bottom 0.254: v23.5,17.14 23.5,12.7 24.13,12.06 H5.4
P1-D3  (via drill 0.3 pad 0.51)
  Top 0.254: v24.13,19.68 U17.4 26.8,19.68 27.69,20.57 27.69,21.46 28.45,22.23 31.24,22.23 31.88,22.86 RA1.2 32.89,22.86 34.16,21.59 36.07,21.59 36.32,21.84 36.32,22.73 36.45,22.86 DA3.2 38.48,22.86 39.13,23.51 DA4.4 | H5.6 28.13,8.83 27.18,7.87 24,7.87 23.5,7.37 17.53,7.37 17.03,6.87 C37.2
  Bottom 0.254: v24.13,19.68 24.77,19.05 24.77,14.22 28.13,10.86 H5.6
P1-D4  (via drill 0.3, 0.3 pad 0.51)
  Top 0.254: v24.13,22.23 U17.6 27.18,22.23 28.45,23.5 30.86,23.5 31.5,24.13 RA1.3 35.52,24.13 | H5.7 30.13,8.79 29.21,7.87 27.94,7.87 27.43,7.37 24.26,7.37 23.75,6.86 17.78,6.86 15.73,4.81 C39.2 | DA3.4 35.52,24.13 | 35.52,24.13 v42.42,24.13 | v42.42,22.86 DA4.2
  Bottom 0.254: v24.13,22.23 25.27,21.08 25.27,14.48 28.83,10.92 29.37,10.92 H5.7 | v42.42,24.13 v42.42,22.86
P2-D0  (via drill 0.3 pad 0.51)
  Top 0.254: C19.2 16.69,31.26 17.69,30.26 U17.11 19.94,27.3 20.57,26.67 v20.7,26.67 20.83,26.54 23.75,26.54 23.88,26.67 RA1.6 30.99,26.67 31.62,26.04 33.27,26.04 34.54,24.77 36.58,24.77 37.12,25.31 DA1.1 38.59,26.02 39.24,26.67 DA2.5
  Bottom 0.254: v20.7,26.67 20.57,26.67 19.56,25.65 18.03,25.65 16.89,24.51 16.89,15.88 16.64,15.62 16.64,8.26 17.53,7.37 19.43,7.37 21.08,5.71 21.08,3.43 21.72,2.79 22.99,2.79 24.13,3.94 H6.4
P2-D3  (via drill 0.3 pad 0.51)
  Top 0.254: v30.61,25.4 RA1.7 28.57,25.4 27.3,24.13 23.88,24.13 23.5,23.75 19.68,23.75 19.3,24.13 18.96,24.13 18.32,24.77 U17.13 16.24,24.77 15.88,25.13 C23.2 | v32.89,27.43 33.27,27.43 33.53,27.18 33.53,26.44 34.7,25.27 36.07,25.27 36.32,25.53 36.32,26.54 36.45,26.67 DA1.2 38.48,26.67 39.13,27.32 DA2.4
  Bottom 0.254: H6.6 29.15,6.1 30.35,6.1 31.24,6.99 31.24,22.35 29.97,23.62 29.97,24.38 30.61,25.02 v30.61,25.4 30.99,25.4 32.89,27.3 v32.89,27.43
P2-D4  (via drill 0.3, 0.3 pad 0.51)